# Altium schematic sheet Sinalização_Leds_Buzzer_Conversor_Nível_Lógico.SchDoc
size A4; SheetNumber: 3; SheetTotal: 4
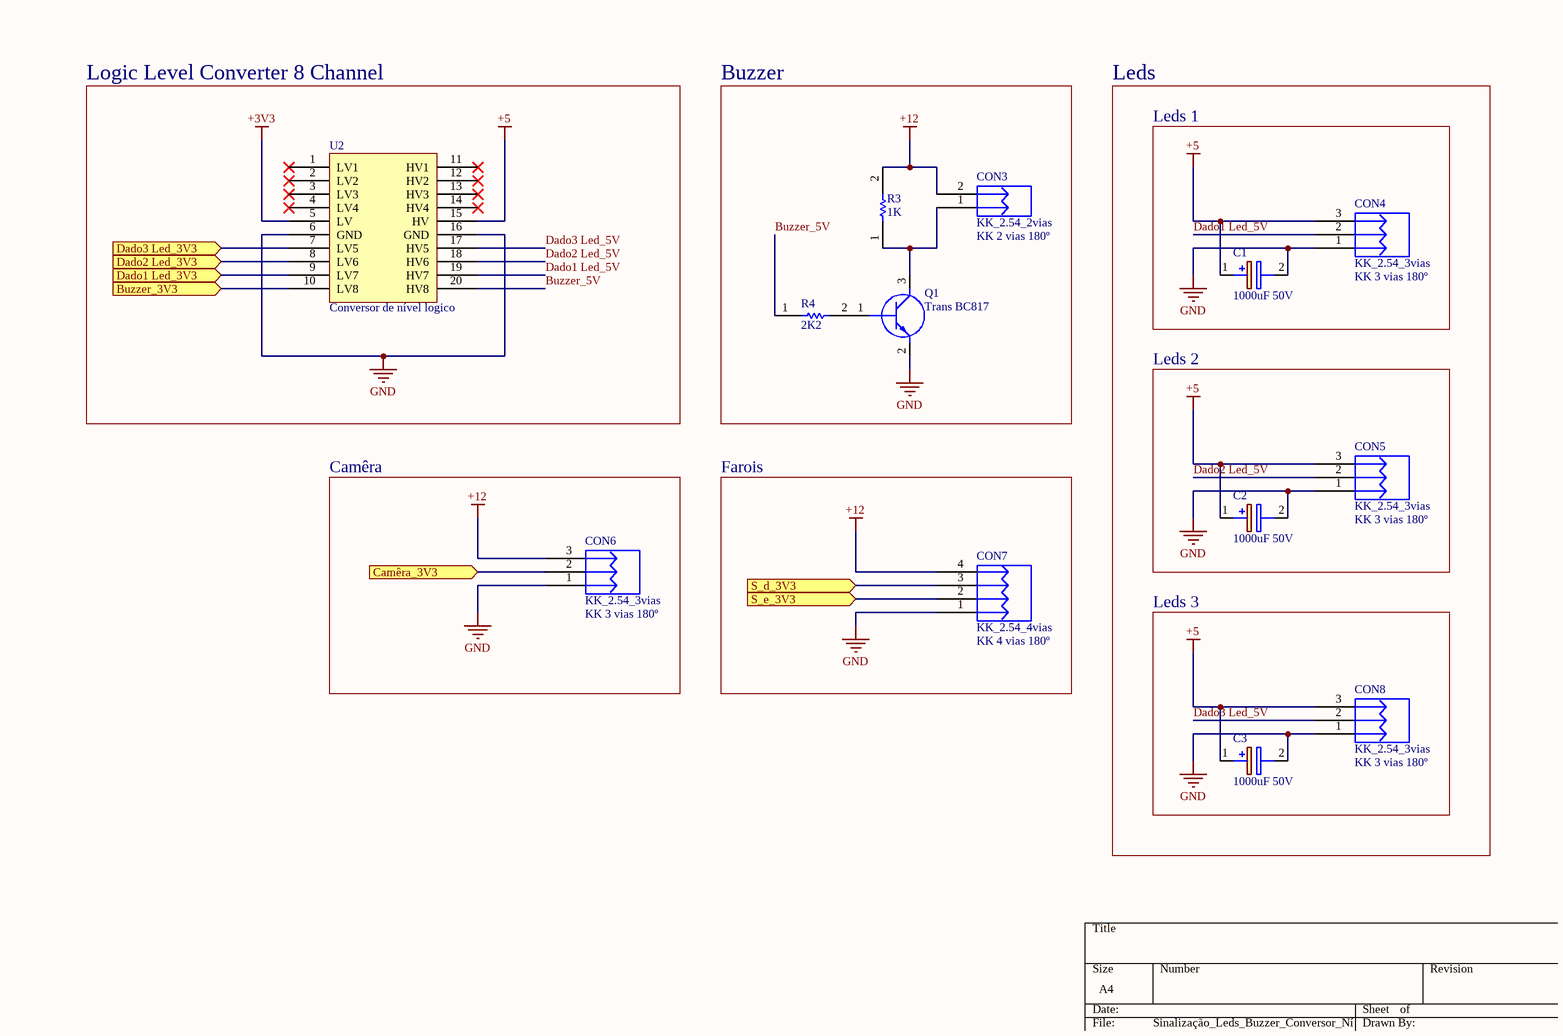
[diagram p0: Sinalização_Leds_Buzzer_Conversor_Nível_Lógico.SchDoc]

## Parts
C1  1000uF 50V  [CAPPRD500W62D1300H2650]
C2  1000uF 50V  [CAPPRD500W62D1300H2650]
C3  1000uF 50V  [CAPPRD500W62D1300H2650]
CON3  KK_2.54_2vias  Valor: KK 2 vias 180º  [KK_2VIAS_180º]
CON4  KK_2.54_3vias  Valor: KK 3 vias 180º  [KK_3vias_180º]
CON5  KK_2.54_3vias  Valor: KK 3 vias 180º  [KK_3vias_180º]
CON6  KK_2.54_3vias  Valor: KK 3 vias 180º  [KK_3vias_180º]
CON7  KK_2.54_4vias  Valor: KK 4 vias 180º  [KK_4vias_180°]
CON8  KK_2.54_3vias  Valor: KK 3 vias 180º  [KK_3vias_180º]
Q1  Trans BC817  [SOT96P240X110-3N]
R3  1K  [RESC3216X60N]
R4  2K2  [RESC3216X60N]
U2  Conversor de nível logico  [Conversor de nível lógico]

## Blocks framed on the sheet
Logic Level Converter 8 Channel: U2
Buzzer: CON3 Q1 R3 R4
Leds 1: C1 CON4
Leds 2: C2 CON5
Camêra: CON6
Farois: CON7
Leds 3: C3 CON8

## Ports
Buzzer_3V3 (in), Camêra_3V3 (in), Dado1 Led_3V3 (in), Dado2 Led_3V3 (in), Dado3 Led_3V3 (in), S_d_3V3 (in), S_e_3V3 (in)

## Nets
+3V3: U2.5(LV)
+5: C1.1(+) C2.1(+) C3.1(+) CON4.3 CON5.3 CON8.3 U2.15(HV)
+12: CON3.2 CON6.3 CON7.4 R3.2
GND: C1.2(-) C2.2(-) C3.2(-) CON4.1 CON5.1 CON6.1 CON7.1 CON8.1 Q1.2(E) U2.6(GND) U2.16(GND)
Buzzer_3V3: U2.10(LV8) ; port Buzzer_3V3
Buzzer_5V: R4.1 U2.20(HV8)
Camêra_3V3: CON6.2 ; port Camêra_3V3
Dado1 Led_3V3: U2.9(LV7) ; port Dado1 Led_3V3
Dado1 Led_5V: CON4.2 U2.19(HV7)
Dado2 Led_3V3: U2.8(LV6) ; port Dado2 Led_3V3
Dado2 Led_5V: CON5.2 U2.18(HV6)
Dado3 Led_3V3: U2.7(LV5) ; port Dado3 Led_3V3
Dado3 Led_5V: CON8.2 U2.17(HV5)
S_d_3V3: CON7.3 ; port S_d_3V3
S_e_3V3: CON7.2 ; port S_e_3V3
NetCON3_1: CON3.1 Q1.3(C) R3.1
NetQ1_1: Q1.1(B) R4.2

Not connected (* = marked no-connect by the designer): U2 1(LV1)* 2(LV2)* 3(LV3)* 4(LV4)* 11(HV1)* 12(HV2)* 13(HV3)* 14(HV4)*

## Notes on the sheet
- Leds

## Library data of the parts
C1-C3 = 1000uF 50V: Capacitor Eletrolitico 1000uF 50V; Manufacturer_Name: Wurth Elektronik; Manufacturer_Part_Number: 860010678024; Datasheet Link: https://www.mouser.com/datasheet/2/445/860010678024-1093799.pdf; Height: 26.5mm; Mouser Part Number: 710-860010678024; Mouser Price/Stock: https://www.mouser.com/Search/Refine.aspx?Keyword=710-860010678024
CON3 = KK_2.54_2vias: Conector KK 2.54mm 2 vias; Descrição: Conector KK 3 vias com passo 2.54mm; Encapsulamento: PTH - 180º; Modelo: 2 vias - 180º; Marca: *; Observação: *
CON4-CON6 CON8 = KK_2.54_3vias: Conector KK 2.54mm 3 vias; Descrição: Conector KK 3 vias com passo 2.54mm; Encapsulamento: PTH - 180º; Modelo: 3 vias - 180º; Marca: *; Observação: *
CON7 = KK_2.54_4vias: Conector KK 2.54mm 4 vias; Descrição: Conector KK 3 vias com passo 2.54mm; Encapsulamento: PTH - 180º; Modelo: 3 vias - 180º; Marca: *; Observação: *
Q1 = Trans BC817: Transistor BJT NPN BC817-25-7-F; Manufacturer_Name: Diodes Inc.; Datasheet Link: https://www.diodes.com/assets/Datasheets/ds11107.pdf; Height: 1.1mm; Manufacturer_Part_Number: BC817-25-7-F; Mouser Part Number: 621-BC817-25-7-F; Mouser Price/Stock: https://www.mouser.co.uk/ProductDetail/Diodes-Incorporated/BC817-25-7-F?qs=rGAXPo9uwV0jK0EyLZnqOw%3D%3D; Arrow Part Number: BC817-25-7-F; Arrow Price/Stock: https://www.arrow.com/en/products/bc817-25-7-f/diodes-incorporated
R3 R4 = Resistor 1206: Resistor; Manufacturer_Name: Vishay; Manufacturer_Part_Number: CRCW12064K70FKEA; Datasheet Link: http://docs-emea.rs-online.com/webdocs/13ec/0900766b813ecc08.pdf; Height: 0.6mm; Mouser Part Number: 71-CRCW1206-4.7K-E3; Mouser Price/Stock: https://www.mouser.co.uk/ProductDetail/Vishay-Dale/CRCW12064K70FKEA?qs=1vm4qhDHCvlKJmatsKzyFQ%3D%3D; Arrow Part Number: CRCW12064K70FKEA; Arrow Price/Stock: https://www.arrow.com/en/products/crcw12064k70fkea/vishay